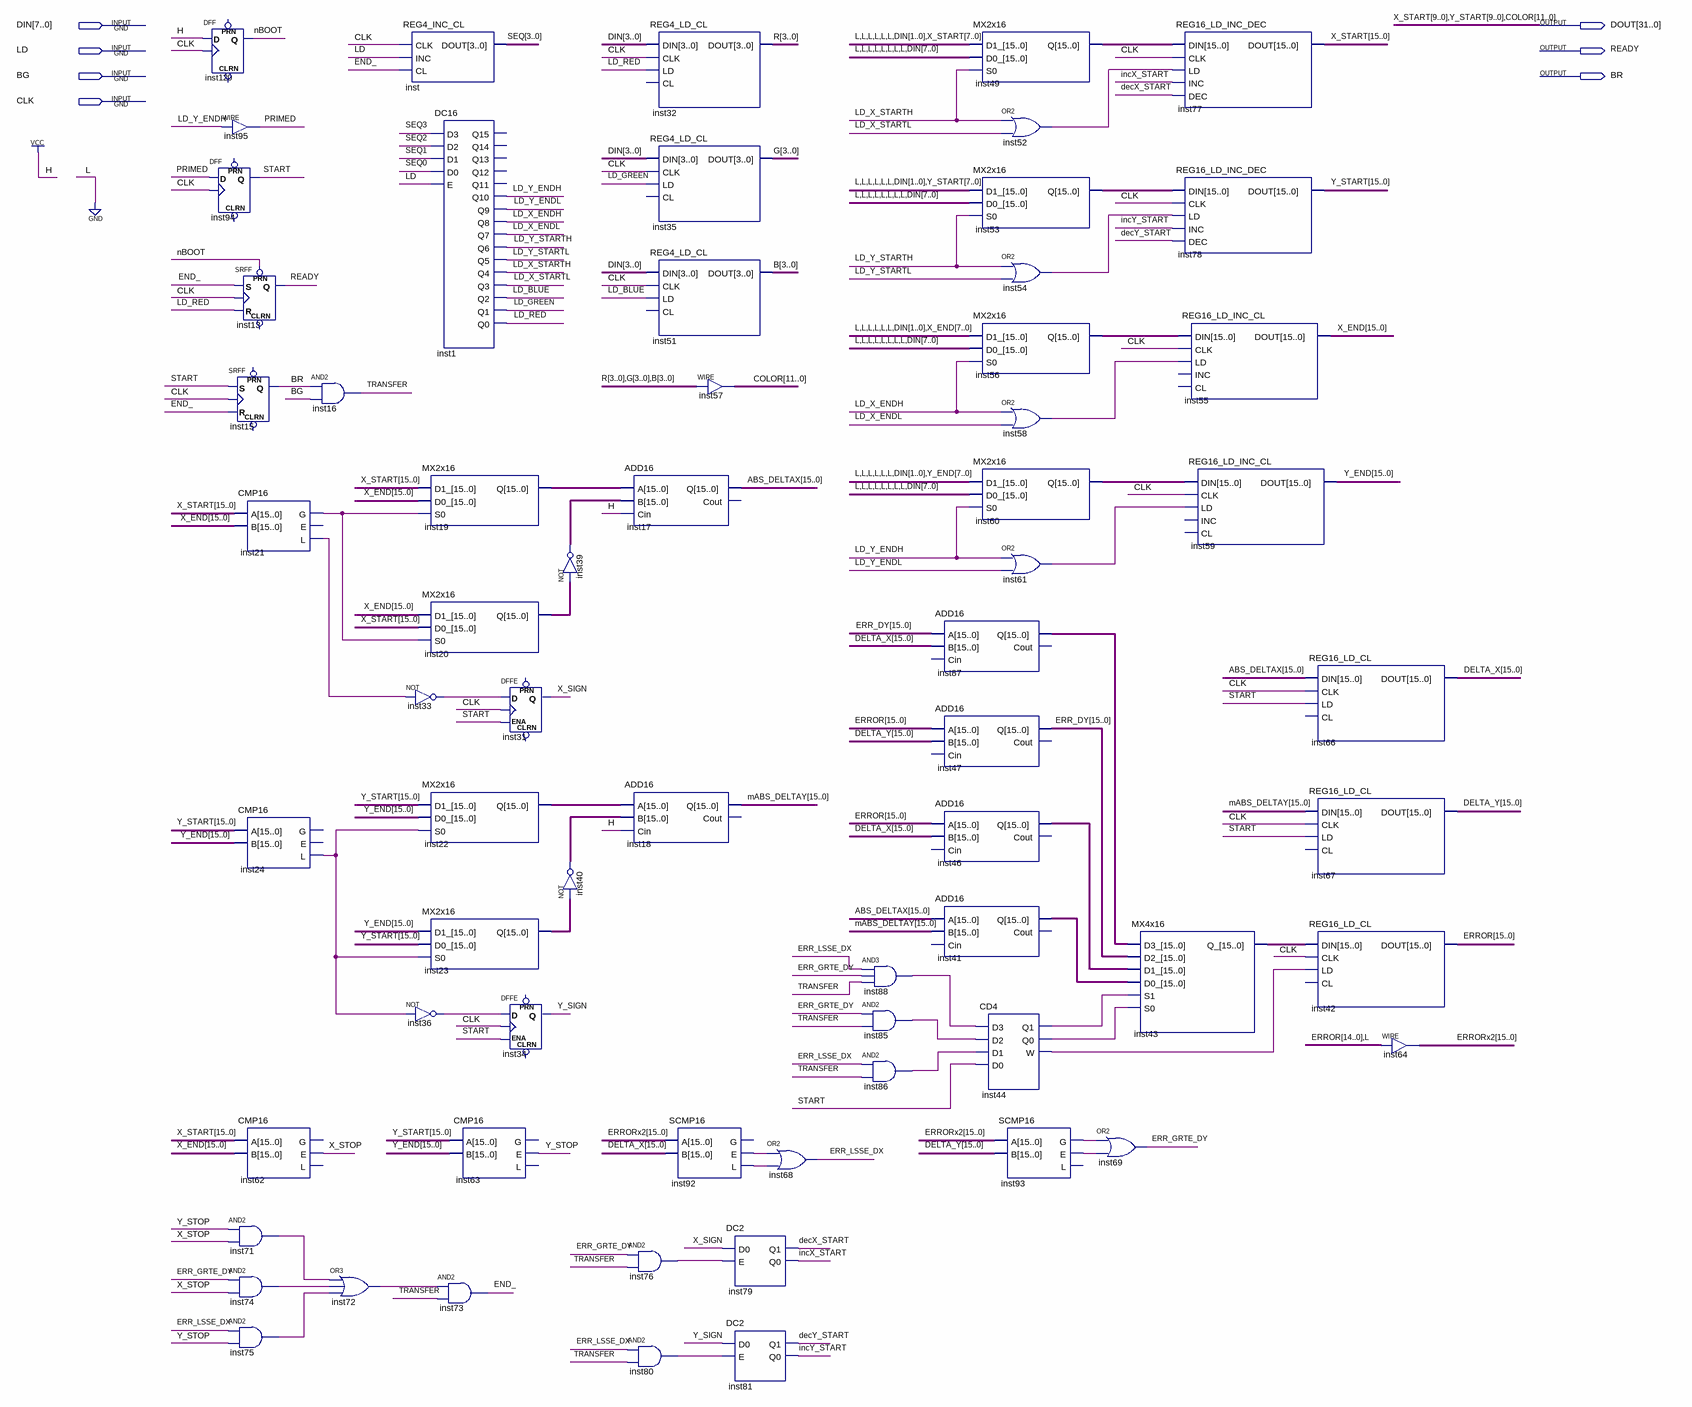
[diagram p0: schematic sheet]
// Quartus schematic render_line.bdf as structural Verilog: 66 symbols, 7 pins
module render_line (
  input  [7:0] DIN,
  input  LD,
  input  BG,
  input  CLK,
  output [31:0] DOUT,
  output READY,
  output BR
);

  wire decX_START, decY_START, END_, ERR_GRTE_DY, ERR_LSSE_DX, incX_START, incY_START, inst21_g, inst21_l,
       inst24_l, inst33_out, inst36_out, inst44_q0, inst44_q1, inst44_w, inst52_out, inst54_out, inst58_out,
       inst61_out, inst71_out, inst72_out, inst74_out, inst75_out, inst76_out, inst80_out, inst85_out,
       inst86_out, inst88_out, inst92_e, inst92_l, inst93_e, inst93_g, LD_BLUE, LD_GREEN, LD_RED, LD_X_ENDH,
       LD_X_ENDL, LD_X_STARTH, LD_X_STARTL, LD_Y_ENDH, LD_Y_ENDL, LD_Y_STARTH, LD_Y_STARTL, nBOOT, PRIMED,
       START, TRANSFER, X_SIGN, X_STOP, Y_SIGN, Y_STOP;
  wire [3:0] B, G, R, SEQ;
  wire [15:0] ABS_DELTAX, DELTA_X, DELTA_Y, ERR_DY, ERROR, ERRORx2, inst19_q, inst20_q, inst22_q, inst23_q,
       inst39_out, inst40_out, inst41_q, inst43_q_, inst46_q, inst49_q, inst53_q, inst56_q, inst60_q,
       inst87_q, mABS_DELTAY, X_END, Y_END;
  wire [15:10] X_START, Y_START;

  DFF inst120 (.CLK(CLK), .D(1'b1), .Q(nBOOT));  // open: CLRN, PRN
  assign PRIMED = LD_Y_ENDH;  // WIRE inst95
  DFF inst94 (.CLK(CLK), .D(PRIMED), .Q(START));  // open: CLRN, PRN
  SRFF inst13 (.PRN(nBOOT), .S(END_), .R(LD_RED), .CLK(CLK), .Q(READY));  // open: CLRN
  SRFF inst15 (.S(START), .R(END_), .CLK(CLK), .Q(BR));  // open: PRN, CLRN
  CMP16 inst21 (.A({X_START, DOUT[31:22]}), .B(X_END), .G(inst21_g), .L(inst21_l));  // open: E
  CMP16 inst24 (.A({Y_START, DOUT[21:12]}), .B(Y_END), .L(inst24_l));  // open: G, E
  CMP16 inst62 (.A({X_START, DOUT[31:22]}), .B(X_END), .E(X_STOP));  // open: G, L
  and inst71 (inst71_out, Y_STOP, X_STOP);
  and inst74 (inst74_out, ERR_GRTE_DY, X_STOP);
  and inst75 (inst75_out, ERR_LSSE_DX, Y_STOP);
  and inst16 (TRANSFER, BR, BG);
  or inst72 (inst72_out, inst71_out, inst74_out, inst75_out);
  REG4_INC_CL inst (.CLK(CLK), .INC(LD), .CL(END_), .DOUT(SEQ));
  MX2x16 inst19 (.D1_({X_START, DOUT[31:22]}), .D0_(X_END), .S0(inst21_g), .Q(inst19_q));
  MX2x16 inst20 (.D1_(X_END), .D0_({X_START, DOUT[31:22]}), .S0(inst21_g), .Q(inst20_q));
  not inst33 (inst33_out, inst21_l);
  MX2x16 inst22 (.D1_({Y_START, DOUT[21:12]}), .D0_(Y_END), .S0(inst24_l), .Q(inst22_q));
  MX2x16 inst23 (.D1_(Y_END), .D0_({Y_START, DOUT[21:12]}), .S0(inst24_l), .Q(inst23_q));
  not inst36 (inst36_out, inst24_l);
  DC16 inst1 (
    .D3(SEQ[3]), .D2(SEQ[2]), .D1(SEQ[1]), .D0(SEQ[0]), .E(LD), .Q10(LD_Y_ENDH), .Q9(LD_Y_ENDL),
    .Q8(LD_X_ENDH), .Q7(LD_X_ENDL), .Q6(LD_Y_STARTH), .Q5(LD_Y_STARTL), .Q4(LD_X_STARTH), .Q3(LD_X_STARTL),
    .Q2(LD_BLUE), .Q1(LD_GREEN), .Q0(LD_RED));  // open: Q15, Q14, Q13, Q12, Q11
  CMP16 inst63 (.A({Y_START, DOUT[21:12]}), .B(Y_END), .E(Y_STOP));  // open: G, L
  and inst73 (END_, inst72_out, TRANSFER);
  DFFE inst31 (.D(inst33_out), .CLK(CLK), .ENA(START), .Q(X_SIGN));  // open: PRN, CLRN
  DFFE inst34 (.D(inst36_out), .CLK(CLK), .ENA(START), .Q(Y_SIGN));  // open: PRN, CLRN
  assign inst39_out = ~inst20_q;  // NOT inst39, 16 bits wide
  assign inst40_out = ~inst23_q;  // NOT inst40, 16 bits wide
  ADD16 inst17 (.A(inst19_q), .B(inst39_out), .Cin(1'b1), .Q(ABS_DELTAX));  // open: Cout
  ADD16 inst18 (.A(inst22_q), .B(inst40_out), .Cin(1'b1), .Q(mABS_DELTAY));  // open: Cout
  and inst76 (inst76_out, ERR_GRTE_DY, TRANSFER);
  and inst80 (inst80_out, ERR_LSSE_DX, TRANSFER);
  REG4_LD_CL inst32 (.DIN(DIN[3:0]), .CLK(CLK), .LD(LD_RED), .DOUT(R));  // open: CL
  REG4_LD_CL inst35 (.DIN(DIN[3:0]), .CLK(CLK), .LD(LD_GREEN), .DOUT(G));  // open: CL
  REG4_LD_CL inst51 (.DIN(DIN[3:0]), .CLK(CLK), .LD(LD_BLUE), .DOUT(B));  // open: CL
  SCMP16 inst92 (.A(ERRORx2), .B(DELTA_X), .E(inst92_e), .L(inst92_l));  // open: G
  assign DOUT[11:0] = {R, G, B};  // WIRE inst57
  DC2 inst79 (.D0(X_SIGN), .E(inst76_out), .Q1(decX_START), .Q0(incX_START));
  DC2 inst81 (.D0(Y_SIGN), .E(inst80_out), .Q1(decY_START), .Q0(incY_START));
  or inst68 (ERR_LSSE_DX, inst92_e, inst92_l);
  and inst88 (inst88_out, ERR_LSSE_DX, ERR_GRTE_DY, TRANSFER);
  and inst85 (inst85_out, ERR_GRTE_DY, TRANSFER);
  and inst86 (inst86_out, ERR_LSSE_DX, TRANSFER);
  ADD16 inst87 (.A(ERR_DY), .B(DELTA_X), .Q(inst87_q));  // open: Cin, Cout
  ADD16 inst47 (.A(ERROR), .B(DELTA_Y), .Q(ERR_DY));  // open: Cin, Cout
  ADD16 inst46 (.A(ERROR), .B(DELTA_X), .Q(inst46_q));  // open: Cin, Cout
  ADD16 inst41 (.A(ABS_DELTAX), .B(mABS_DELTAY), .Q(inst41_q));  // open: Cin, Cout
  MX2x16 inst49 (.D1_({{6{1'b0}}, DIN[1:0], DOUT[29:22]}), .D0_({{8{1'b0}}, DIN}), .S0(LD_X_STARTH), .Q(inst49_q));
  MX2x16 inst53 (.D1_({{6{1'b0}}, DIN[1:0], DOUT[19:12]}), .D0_({{8{1'b0}}, DIN}), .S0(LD_Y_STARTH), .Q(inst53_q));
  MX2x16 inst56 (.D1_({{6{1'b0}}, DIN[1:0], X_END[7:0]}), .D0_({{8{1'b0}}, DIN}), .S0(LD_X_ENDH), .Q(inst56_q));
  MX2x16 inst60 (.D1_({{6{1'b0}}, DIN[1:0], Y_END[7:0]}), .D0_({{8{1'b0}}, DIN}), .S0(LD_Y_ENDH), .Q(inst60_q));
  CD4 inst44 (
    .D3(inst88_out), .D2(inst85_out), .D1(inst86_out), .D0(START), .Q1(inst44_q1), .Q0(inst44_q0),
    .W(inst44_w));
  or inst52 (inst52_out, LD_X_STARTH, LD_X_STARTL);
  or inst54 (inst54_out, LD_Y_STARTH, LD_Y_STARTL);
  or inst58 (inst58_out, LD_X_ENDH, LD_X_ENDL);
  or inst61 (inst61_out, LD_Y_ENDH, LD_Y_ENDL);
  SCMP16 inst93 (.A(ERRORx2), .B(DELTA_Y), .G(inst93_g), .E(inst93_e));  // open: L
  MX4x16 inst43 (
    .D3_(inst87_q), .D2_(ERR_DY), .D1_(inst46_q), .D0_(inst41_q), .S1(inst44_q1), .S0(inst44_q0),
    .Q_(inst43_q_));
  or inst69 (ERR_GRTE_DY, inst93_g, inst93_e);
  REG16_LD_INC_DEC inst77 (
    .DIN(inst49_q), .CLK(CLK), .LD(inst52_out), .INC(incX_START), .DEC(decX_START),
    .DOUT({X_START, DOUT[31:22]}));
  REG16_LD_INC_DEC inst78 (
    .DIN(inst53_q), .CLK(CLK), .LD(inst54_out), .INC(incY_START), .DEC(decY_START),
    .DOUT({Y_START, DOUT[21:12]}));
  REG16_LD_INC_CL inst55 (.DIN(inst56_q), .CLK(CLK), .LD(inst58_out), .DOUT(X_END));  // open: INC, CL
  REG16_LD_INC_CL inst59 (.DIN(inst60_q), .CLK(CLK), .LD(inst61_out), .DOUT(Y_END));  // open: INC, CL
  REG16_LD_CL inst66 (.DIN(ABS_DELTAX), .CLK(CLK), .LD(START), .DOUT(DELTA_X));  // open: CL
  REG16_LD_CL inst67 (.DIN(mABS_DELTAY), .CLK(CLK), .LD(START), .DOUT(DELTA_Y));  // open: CL
  REG16_LD_CL inst42 (.DIN(inst43_q_), .CLK(CLK), .LD(inst44_w), .DOUT(ERROR));  // open: CL
  assign ERRORx2 = {ERROR[14:0], 1'b0};  // WIRE inst64

  // Other names for the same wires on the sheet: COLOR[11:0] = DOUT[11:0]; X_START[9:0] = DOUT[31:22];
  //   Y_START[9:0] = DOUT[21:12]
endmodule
